# Altium schematic sheet STM32Fx.SchDoc
size A4; DocumentNumber: 3; Revision: A.1(PCB.SCH); SheetNumber: 3; SheetTotal: 3
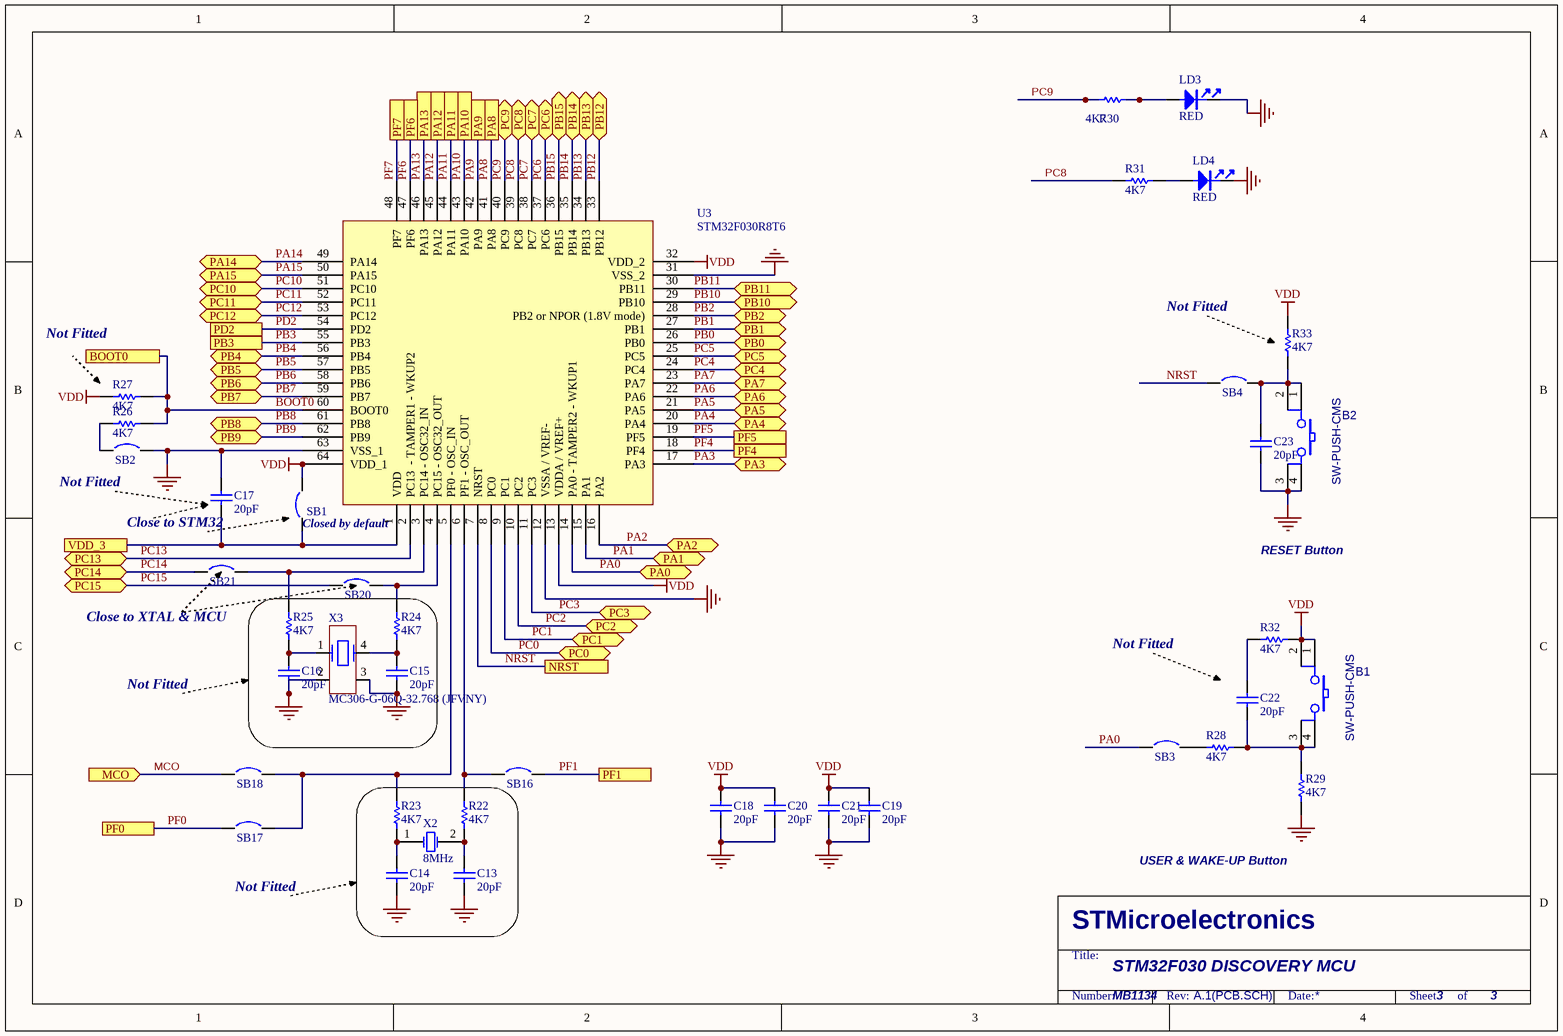
[diagram p0: STM32Fx.SchDoc]

## Parts
B1  SW-PUSH-CMS  [SW_TL6120DF300QG]
B2  SW-PUSH-CMS  [SW_TL6120DF300QG]
C13  20pF  [CAPC1608X90]
C14  20pF  [CAPC1608X90]
C15  20pF  [CAPC1608X90]
C16  20pF  [CAPC1608X90]
C17  20pF  [CAPC1608X90]
C18  20pF  [CAPC1608X90]
C19  20pF  [CAPC1608X90]
C20  20pF  [CAPC1608X90]
C21  20pF  [CAPC1608X90]
C22  20pF  [CAPC1608X90]
C23  20pF  [CAPC1608X90]
LD3  RED  [LED_SML-D12Y1WT86]
LD4  RED  [LED_SML-D12Y1WT86]
R22  4K7  [RESC1005X35N]
R23  4K7  [RESC1005X35N]
R24  4K7  [RESC1005X35N]
R25  4K7  [RESC1005X35N]
R26  4K7  [RESC1005X35N]
R27  4K7  [RESC1005X35N]
R28  4K7  [RESC1005X35N]
R29  4K7  [RESC1005X35N]
R30  4K7  [RESC1005X35N]
R31  4K7  [RESC1005X35N]
R32  4K7  [RESC1005X35N]
R33  4K7  [RESC1005X35N]
SB1  Circuit Breaker  [RESC1005X35N]  (value not drawn)
SB2  Circuit Breaker  [RESC1005X35N]  (value not drawn)
SB3  Circuit Breaker  [RESC1005X35N]  (value not drawn)
SB4  Circuit Breaker  [RESC1005X35N]  (value not drawn)
SB16  Circuit Breaker  [RESC1005X35N]  (value not drawn)
SB17  Circuit Breaker  [RESC1005X35N]  (value not drawn)
SB18  Circuit Breaker  [RESC1005X35N]  (value not drawn)
SB20  Circuit Breaker  [RESC1005X35N]  (value not drawn)
SB21  Circuit Breaker  [RESC1005X35N]  (value not drawn)
U3  STM32F030R8T6  [QFP50P1200X1200X160-64N]
X2  8MHz  [XTAL_ECS-080-20-5PX-TR]
X3  MC306-G-06Q-32.768 (JFVNY)  [*XTAL_MC-306_32.7680K-A:_ROHS]

## Ports
BOOT0, MCO (in), NRST, PA0 (bidir), PA1 (bidir), PA2 (bidir), PA3 (bidir), PA4 (bidir), PA5 (bidir), PA6 (bidir), PA7 (bidir), PA8, PA9, PA10, PA11, PA12, PA13, PA14 (bidir), PA15 (bidir), PB0 (bidir), PB1 (bidir), PB2 (bidir), PB3, PB4 (bidir), PB5 (bidir), PB6 (bidir), PB7 (bidir), PB8 (bidir), PB9 (bidir), PB10 (bidir), PB11 (bidir), PB12 (bidir), PB13 (bidir), PB14 (bidir), PB15 (bidir), PC0 (bidir), PC1 (bidir), PC2 (bidir), PC3 (bidir), PC4 (bidir), PC5 (bidir), PC6 (bidir), PC7 (bidir), PC8 (bidir), PC9 (bidir), PC10 (bidir), PC11 (bidir), PC12 (bidir), PC13 (bidir), PC14 (bidir), PC15 (bidir), PD2, PF0, PF1, PF4, PF5, PF6, PF7, VDD_3

## Nets
GND: B2.3 B2.4 C13.1 C14.1 C15.1 C16.1 C17.2 C18.1 C19.2 C20.2 C21.2 C23.1 LD3.2 LD4.2 R29.1 SB2.2 U3.12(VSSA_/_VREF-) U3.31(VSS_2) U3.63(VSS_1) X3.2 X3.3
VDD: B1.1 B1.2 C18.2 C19.1 C20.1 C21.1 R27.1 R32.2 R33.2 SB1.2 U3.13(VDDA_/_VREF+) U3.32(VDD_2) U3.64(VDD_1)
BOOT0: R26.2 R27.2 U3.60(BOOT0) ; port BOOT0
MCO: SB18.1 ; port MCO
NRST: SB4.1 U3.7(NRST) ; port NRST
PA0: SB3.1 U3.14(PA0_-_TAMPER2_-_WKUP1) ; port PA0
PA1: U3.15(PA1) ; port PA1
PA2: U3.16(PA2) ; port PA2
PA3: U3.17(PA3) ; port PA3
PA4: U3.20(PA4) ; port PA4
PA5: U3.21(PA5) ; port PA5
PA6: U3.22(PA6) ; port PA6
PA7: U3.23(PA7) ; port PA7
PA8: U3.41(PA8) ; port PA8
PA9: U3.42(PA9) ; port PA9
PA10: U3.43(PA10) ; port PA10
PA11: U3.44(PA11) ; port PA11
PA12: U3.45(PA12) ; port PA12
PA13: U3.46(PA13) ; port PA13
PA14: U3.49(PA14) ; port PA14
PA15: U3.50(PA15) ; port PA15
PB0: U3.26(PB0) ; port PB0
PB1: U3.27(PB1) ; port PB1
PB2: U3.28(PB2_or_NPOR_(1.8V_mode)) ; port PB2
PB3: U3.55(PB3) ; port PB3
PB4: U3.56(PB4) ; port PB4
PB5: U3.57(PB5) ; port PB5
PB6: U3.58(PB6) ; port PB6
PB7: U3.59(PB7) ; port PB7
PB8: U3.61(PB8) ; port PB8
PB9: U3.62(PB9) ; port PB9
PB10: U3.29(PB10) ; port PB10
PB11: U3.30(PB11) ; port PB11
PB12: U3.33(PB12) ; port PB12
PB13: U3.34(PB13) ; port PB13
PB14: U3.35(PB14) ; port PB14
PB15: U3.36(PB15) ; port PB15
PC0: U3.8(PC0) ; port PC0
PC1: U3.9(PC1) ; port PC1
PC2: U3.10(PC2) ; port PC2
PC3: U3.11(PC3) ; port PC3
PC4: U3.24(PC4) ; port PC4
PC5: U3.25(PC5) ; port PC5
PC6: U3.37(PC6) ; port PC6
PC7: U3.38(PC7) ; port PC7
PC8: R31.1 U3.39(PC8) ; port PC8
PC9: R30.1 U3.40(PC9) ; port PC9
PC10: U3.51(PC10) ; port PC10
PC11: U3.52(PC11) ; port PC11
PC12: U3.53(PC12) ; port PC12
PC13: U3.2(PC13__-_TAMPER1_-_WKUP2) ; port PC13
PC14: SB21.1 ; port PC14
PC15: SB20.1 ; port PC15
PD2: U3.54(PD2) ; port PD2
PF0: SB17.1 ; port PF0
PF1: SB16.2 ; port PF1
PF4: U3.18(PF4) ; port PF4
PF5: U3.19(PF5) ; port PF5
PF6: U3.47(PF6) ; port PF6
PF7: U3.48(PF7) ; port PF7
VDD_3: C17.1 SB1.1 U3.1(VDD) ; port VDD_3
NetB1_3: B1.3 B1.4 C22.1 R28.2 R29.2
NetB2_1: B2.1 B2.2 C23.2 R33.1 SB4.2
NetC13_2: C13.2 R22.2 X2.2(OSC2)
NetC14_2: C14.2 R23.1 X2.1(OSC1)
NetC15_2: C15.2 R24.1 X3.4
NetC16_2: C16.2 R25.1 X3.1
NetC22_2: C22.2 R32.1
NetLD3_1: LD3.1 R30.2
NetLD4_1: LD4.1 R31.2
NetR22_1: R22.1 SB16.1 U3.6(PF1_-_OSC_OUT)
NetR23_2: R23.2 SB17.2 SB18.2 U3.5(PF0_-_OSC_IN)
NetR24_2: R24.2 SB20.2 U3.4(PC15_-_OSC32_OUT)
NetR25_2: R25.2 SB21.2 U3.3(PC14_-_OSC32_IN)
NetR26_1: R26.1 SB2.1
NetR28_1: R28.1 SB3.2

## Notes on the sheet
- Not Fitted
- (near SB2) Not Fitted
- (near C17) Close to STM32
- (near SB1) Closed by default
- RESET Button
- (near SB21) Close to XTAL & MCU
- (near SB17) Not Fitted
- USER & WAKE-UP Button
- STM32F030 DISCOVERY MCU
- MB1134
- STMicroelectronics
- Title:
- Number:
- Rev:
- Date:
- Sheet       of

## Library data of the parts
B1 B2 = SW-PUSH-CMS: Non-Open Push-Button 0.1A 24V; Manuf_Part_1: TD-0341; Ref St: ********; cap_dec: ---; Footprint: BP1CMS; Manuf_1: http://www.xiejia.net/
C13-C23 = Cap: Capacitor; Published: 8-Jun-2000; Publisher: Altium Limited; Value: 20pF; Revision: July-2002: Re-released for DXP Platform.
LD3 LD4 = PHOTO
R22-R33 = res1: Resistor; Published: 8-Jun-2000; Revision: July-2002: Re-released for DXP Platform.; Publisher: Altium Limited; Value: 4K7
SB1-SB4 SB16-SB18 SB20 SB21 = Circuit Breaker: Solder: NO; Published: 24-Mar-1999; Revision: July-2002: Re-released for DXP Platform.; Publisher: Altium Limited
U3 = STM32F030R8T6: Advanced ARM based 32-bit Cortex M0 MCU with 64 Kbytes Flash and 8 Kbytes of SRAM; Manuf_1: STM; Manuf_Part_1: STM32F051R8T6; Provided: ST; Order: STM32F051R8T6; Distrib: ST
X2 = XTAL: Crystal Oscillator; Published: 8-Jun-2000; LatestRevisionDate: 17-Jul-2002; LatestRevisionNote: Re-released for DXP Platform.; PackageReference: R38; Publisher: Altium Limited
X3 = MC306: Fitted: NO